# Altium schematic sheet 11_SDIO_SDMMC.SchDoc: P30L
size A3; Organization: 六零加智能科技; Address4: www.nidone.com.cn; DocumentNumber: kang jin; Revision: 1.0; SheetNumber: 11; SheetTotal: 23
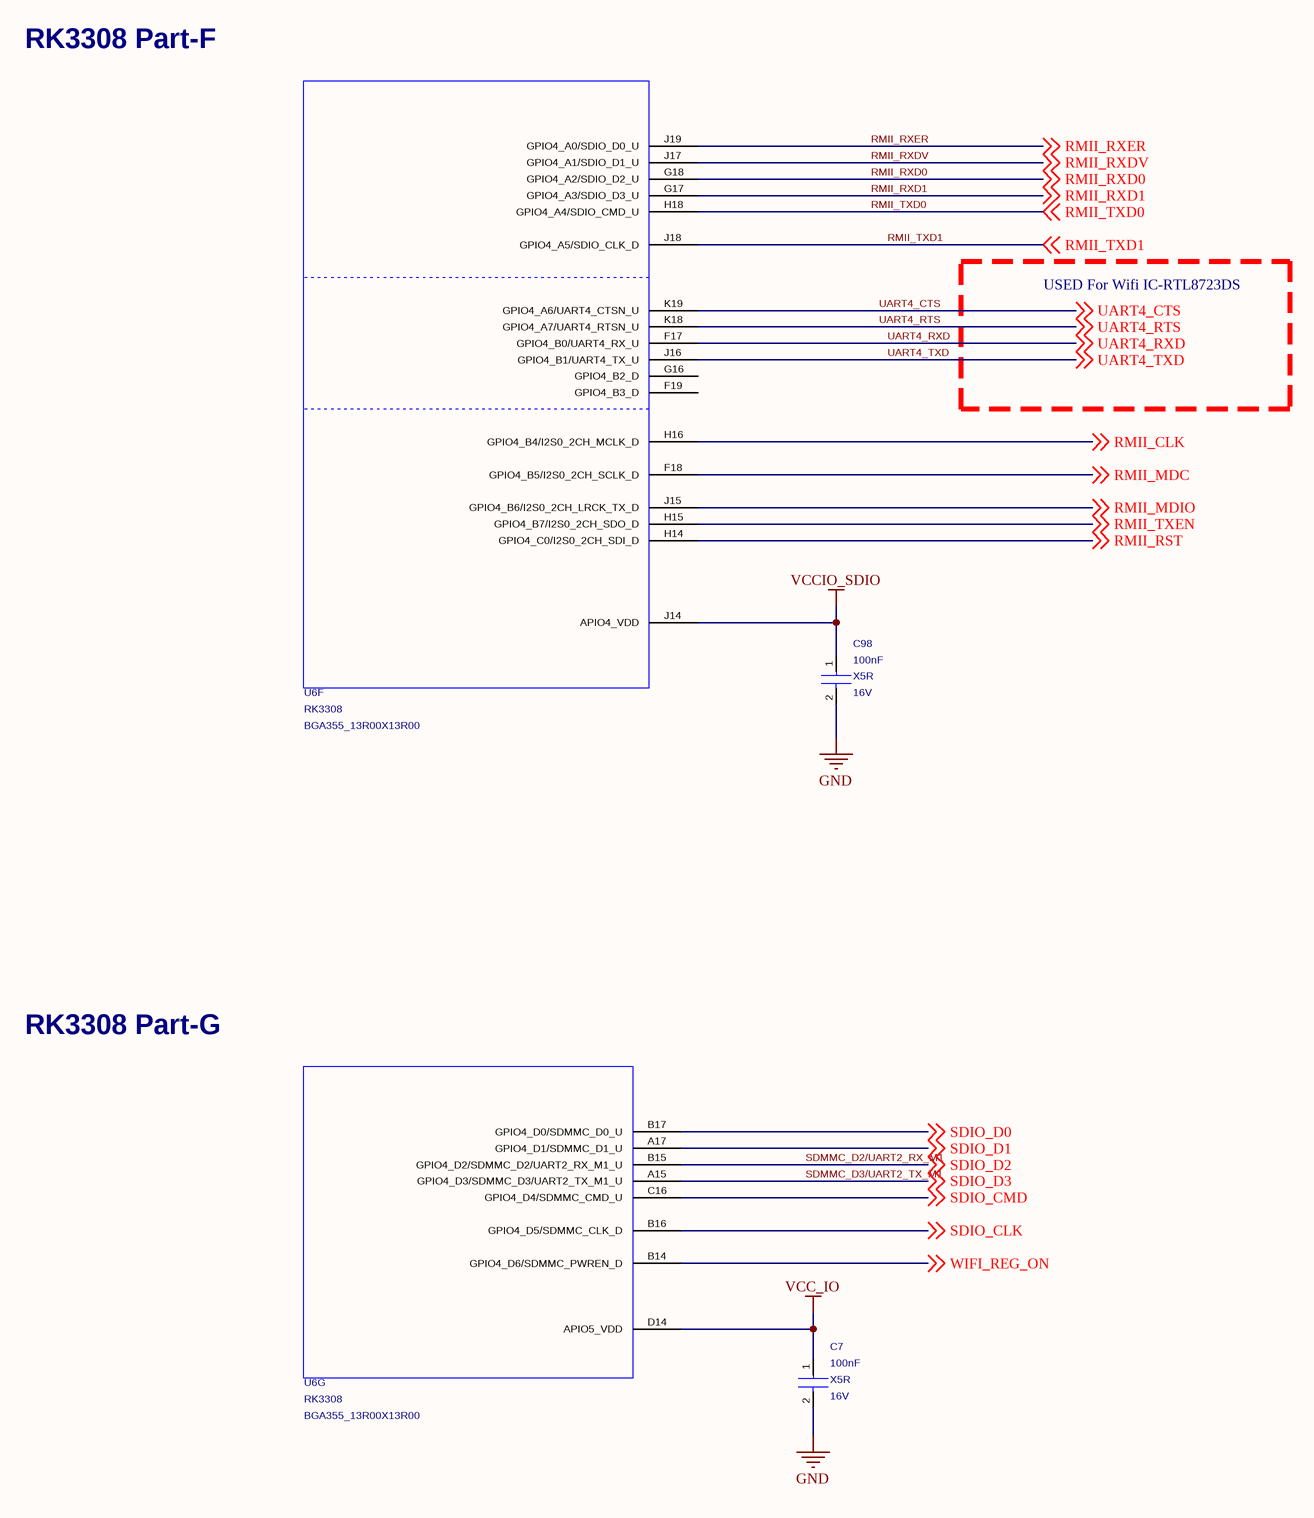
[diagram p0: 11_SDIO_SDMMC.SchDoc]

## Parts
C7  value 100nF  Voltage: 16V  Dielectric: X5R  [C0402]  (hidden comment: CAP_NP_2)
C98  value 100nF  Dielectric: X5R  Voltage: 16V  [C0402]  (hidden comment: CAP_NP_2)
U6  RK3308  [BGA355_13R00X13R00]  (parts F,G of 14)

## Nets
GND: C7.2 C98.2
VCC_IO: C7.1 U6.D14(APIO5_VDD)
VCCIO_SDIO: C98.1 U6.J14(APIO4_VDD)
RMII_CLK: U6.H16(GPIO4_B4/I2S0_2CH_MCLK_D) ; off-sheet RMII_CLK
RMII_MDC: U6.F18(GPIO4_B5/I2S0_2CH_SCLK_D) ; off-sheet RMII_MDC
RMII_MDIO: U6.J15(GPIO4_B6/I2S0_2CH_LRCK_TX_D) ; off-sheet RMII_MDIO
RMII_RST: U6.H14(GPIO4_C0/I2S0_2CH_SDI_D) ; off-sheet RMII_RST
RMII_RXD0: U6.G18(GPIO4_A2/SDIO_D2_U) ; off-sheet RMII_RXD0
RMII_RXD1: U6.G17(GPIO4_A3/SDIO_D3_U) ; off-sheet RMII_RXD1
RMII_RXDV: U6.J17(GPIO4_A1/SDIO_D1_U) ; off-sheet RMII_RXDV
RMII_RXER: U6.J19(GPIO4_A0/SDIO_D0_U) ; off-sheet RMII_RXER
RMII_TXD0: U6.H18(GPIO4_A4/SDIO_CMD_U) ; off-sheet RMII_TXD0
RMII_TXD1: U6.J18(GPIO4_A5/SDIO_CLK_D) ; off-sheet RMII_TXD1
RMII_TXEN: U6.H15(GPIO4_B7/I2S0_2CH_SDO_D) ; off-sheet RMII_TXEN
SDIO_CLK: U6.B16(GPIO4_D5/SDMMC_CLK_D) ; off-sheet SDIO_CLK
SDIO_CMD: U6.C16(GPIO4_D4/SDMMC_CMD_U) ; off-sheet SDIO_CMD
SDIO_D0: U6.B17(GPIO4_D0/SDMMC_D0_U) ; off-sheet SDIO_D0
SDIO_D1: U6.A17(GPIO4_D1/SDMMC_D1_U) ; off-sheet SDIO_D1
SDMMC_D2/UART2_RX_M1: U6.B15(GPIO4_D2/SDMMC_D2/UART2_RX_M1_U) ; off-sheet SDIO_D2  [also labelled SDIO_D2]
SDMMC_D3/UART2_TX_M1: U6.A15(GPIO4_D3/SDMMC_D3/UART2_TX_M1_U) ; off-sheet SDIO_D3  [also labelled SDIO_D3]
UART4_CTS: U6.K19(GPIO4_A6/UART4_CTSN_U) ; off-sheet UART4_CTS
UART4_RTS: U6.K18(GPIO4_A7/UART4_RTSN_U) ; off-sheet UART4_RTS
UART4_RXD: U6.F17(GPIO4_B0/UART4_RX_U) ; off-sheet UART4_RXD
UART4_TXD: U6.J16(GPIO4_B1/UART4_TX_U) ; off-sheet UART4_TXD
WIFI_REG_ON: U6.B14(GPIO4_D6/SDMMC_PWREN_D) ; off-sheet WIFI_REG_ON

Not connected (* = marked no-connect by the designer): U6 F19(GPIO4_B3_D) G16(GPIO4_B2_D)

## Notes on the sheet
- RK3308 Part-F
- USED For Wifi IC-RTL8723DS
- RK3308 Part-G
- Title
- Size:
- Date:
- A3
- Engineer:
- Time:
- Revision:
- Sheet
- of
- File:

## Library data of the parts
C7 = CAP_NP_2: cap,100.00nF,+/-10%,16V,X5R,C0402; Manufacturer_PN: C1005X5R1C104K050BA; Manufacturer: TDK; Created_by: JJJ; Tolerance: 10%; Priority: A; Source_Path: Z:\RK_STANDARD_LIBRARY\CADENCE_CIS\RK_DISCRETE.OLB; Number: 1; PCB DECAL: C0402; Part_Type: C0402; RK_PN: C1005X5R1C104K050BA
C98 = CAP_NP_2: cap,100.00nF,+/-10%,16V,X5R,C0402; Manufacturer: TDK; RK_PN: C1005X5R1C104K050BA; Priority: A; Tolerance: 10%; Created_by: JJJ; Source_Path: Z:\RK_STANDARD_LIBRARY\CADENCE_CIS\RK_DISCRETE.OLB; Number: 1; PCB DECAL: C0402; Part_Type: C0402; Manufacturer_PN: C1005X5R1C104K050BA
U6 = RK3308: Manufacturer: ROCKCHIP; Source_Path: E:\SCHEMETIC\RKSCH.OLB; Number: 1; Manufacturer_PN: RK3308; PCB DECAL: BGA355_13R00X13R00; Value: RK3308